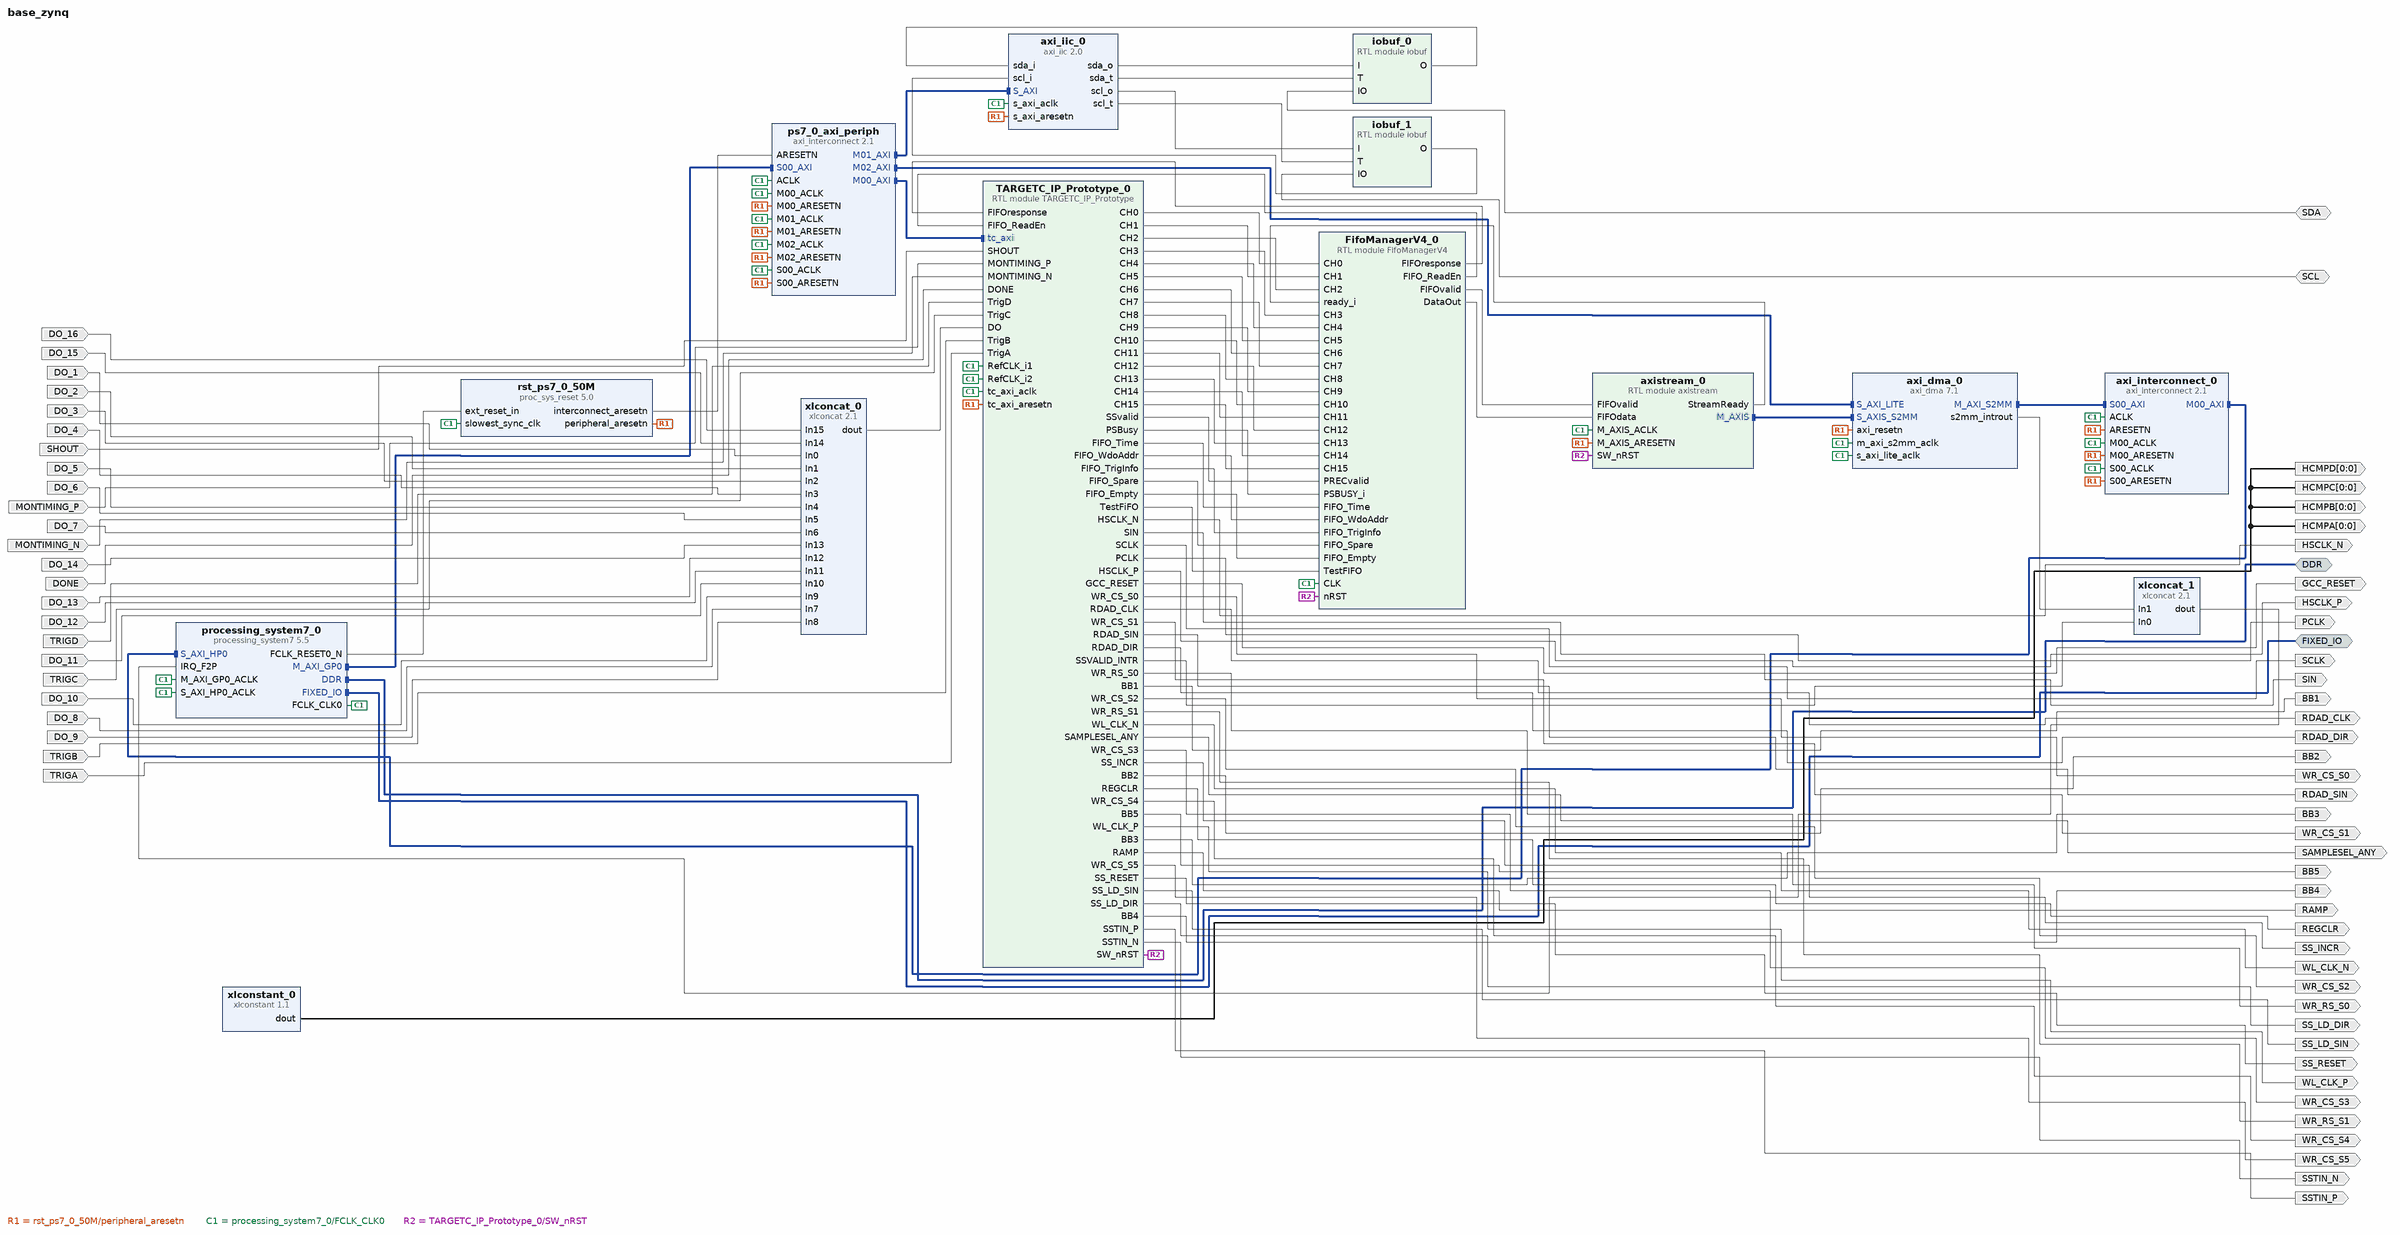
[diagram p0: block diagram of the top level]
# Vivado block design base_zynq, xc7z010clg400-1, Vivado 2018.2
create_bd_design base_zynq

create_bd_intf_port -mode Master -vlnv xilinx.com:interface:ddrx_rtl:1.0 DDR
create_bd_intf_port -mode Master -vlnv xilinx.com:display_processing_system7:fixedio_rtl:1.0 FIXED_IO
create_bd_port -dir I DO_16
create_bd_port -dir I DO_15
create_bd_port -dir I DO_1
create_bd_port -dir I DO_2
create_bd_port -dir I DO_3
create_bd_port -dir I DO_4
create_bd_port -dir I DO_5
create_bd_port -dir I DO_6
create_bd_port -dir I DO_7
create_bd_port -dir I DO_14
create_bd_port -dir I DO_13
create_bd_port -dir I DO_12
create_bd_port -dir I DO_11
create_bd_port -dir I DO_10
create_bd_port -dir I DO_8
create_bd_port -dir I DO_9
create_bd_port -dir IO SDA
create_bd_port -dir IO SCL
create_bd_port -dir O SIN
create_bd_port -dir O SCLK
create_bd_port -dir O PCLK
create_bd_port -dir O HSCLK_P
create_bd_port -dir O HSCLK_N
create_bd_port -dir O WR_RS_S1
create_bd_port -dir O WR_RS_S0
create_bd_port -dir O WR_CS_S0
create_bd_port -dir O WR_CS_S1
create_bd_port -dir O WR_CS_S2
create_bd_port -dir O WR_CS_S3
create_bd_port -dir O WR_CS_S4
create_bd_port -dir O WR_CS_S5
create_bd_port -dir O GCC_RESET
create_bd_port -dir O -type clk WL_CLK_P
create_bd_port -dir O -type clk WL_CLK_N
create_bd_port -dir O RDAD_CLK
create_bd_port -dir O RDAD_SIN
create_bd_port -dir O RDAD_DIR
create_bd_port -dir O SAMPLESEL_ANY
create_bd_port -dir O SS_INCR
create_bd_port -dir O -type rst SS_RESET
create_bd_port -dir O REGCLR
create_bd_port -dir O SS_LD_SIN
create_bd_port -dir O SS_LD_DIR
create_bd_port -dir O RAMP
create_bd_port -dir O SSTIN_P
create_bd_port -dir O SSTIN_N
create_bd_port -dir O BB1
create_bd_port -dir O BB5
create_bd_port -dir I SHOUT
create_bd_port -dir I MONTIMING_P
create_bd_port -dir I MONTIMING_N
create_bd_port -dir I DONE
create_bd_port -dir I TRIGD
create_bd_port -dir I TRIGC
create_bd_port -dir I TRIGB
create_bd_port -dir I TRIGA
create_bd_port -dir O -from 0 -to 0 HCMPA
create_bd_port -dir O -from 0 -to 0 HCMPB
create_bd_port -dir O -from 0 -to 0 HCMPC
create_bd_port -dir O -from 0 -to 0 HCMPD
create_bd_port -dir O BB2
create_bd_port -dir O BB3
create_bd_port -dir O BB4

create_bd_cell -type ip -vlnv xilinx.com:ip:axi_interconnect:2.1 ps7_0_axi_periph
set_property -dict {CONFIG.NUM_SI 1 CONFIG.NUM_MI 3} [get_bd_cells ps7_0_axi_periph]
create_bd_cell -type ip -vlnv xilinx.com:ip:processing_system7:5.5 processing_system7_0
set_property -dict [list \
  CONFIG.PCW_UIPARAM_DDR_FREQ_MHZ 533.333333 \
  CONFIG.PCW_APU_PERIPHERAL_FREQMHZ 666.666666 \
  CONFIG.PCW_SDIO_PERIPHERAL_FREQMHZ 50 \
  CONFIG.PCW_UART_PERIPHERAL_FREQMHZ 50 \
  CONFIG.PCW_FPGA0_PERIPHERAL_FREQMHZ 100 \
  CONFIG.PCW_FPGA1_PERIPHERAL_FREQMHZ 100 \
  CONFIG.PCW_USE_S_AXI_HP0 1 \
  CONFIG.PCW_USE_FABRIC_INTERRUPT 1 \
  CONFIG.PCW_S_AXI_HP0_DATA_WIDTH 32 \
  CONFIG.PCW_IRQ_F2P_INTR 1 \
  CONFIG.PCW_PERIPHERAL_BOARD_PRESET part0 \
  CONFIG.PCW_PRESET_BANK0_VOLTAGE {LVCMOS 2.5V} \
  CONFIG.PCW_PRESET_BANK1_VOLTAGE {LVCMOS 1.8V} \
  CONFIG.PCW_UIPARAM_DDR_PARTNO {MT41K256M16 RE-125} \
  CONFIG.PCW_QSPI_PERIPHERAL_ENABLE 1 \
  CONFIG.PCW_QSPI_QSPI_IO {MIO 1 .. 6} \
  CONFIG.PCW_QSPI_GRP_SINGLE_SS_ENABLE 1 \
  CONFIG.PCW_QSPI_GRP_SINGLE_SS_IO {MIO 1 .. 6} \
  CONFIG.PCW_SINGLE_QSPI_DATA_MODE x4 \
  CONFIG.PCW_QSPI_GRP_FBCLK_ENABLE 1 \
  CONFIG.PCW_QSPI_GRP_FBCLK_IO {MIO 8} \
  CONFIG.PCW_ENET0_PERIPHERAL_ENABLE 1 \
  CONFIG.PCW_ENET0_ENET0_IO {MIO 16 .. 27} \
  CONFIG.PCW_ENET0_GRP_MDIO_ENABLE 1 \
  CONFIG.PCW_ENET0_GRP_MDIO_IO {MIO 52 .. 53} \
  CONFIG.PCW_ENET_RESET_ENABLE 1 \
  CONFIG.PCW_ENET_RESET_SELECT {Share reset pin} \
  CONFIG.PCW_ENET0_RESET_ENABLE 1 \
  CONFIG.PCW_ENET0_RESET_IO {MIO 11} \
  CONFIG.PCW_SD0_PERIPHERAL_ENABLE 1 \
  CONFIG.PCW_SD0_SD0_IO {MIO 40 .. 45} \
  CONFIG.PCW_SD0_GRP_CD_ENABLE 1 \
  CONFIG.PCW_SD0_GRP_CD_IO {MIO 46} \
  CONFIG.PCW_SD0_GRP_WP_ENABLE 1 \
  CONFIG.PCW_SD0_GRP_WP_IO {MIO 50} \
  CONFIG.PCW_UART1_PERIPHERAL_ENABLE 1 \
  CONFIG.PCW_UART1_UART1_IO {MIO 48 .. 49} \
  CONFIG.PCW_TTC0_PERIPHERAL_ENABLE 1 \
  CONFIG.PCW_TTC0_TTC0_IO EMIO \
  CONFIG.PCW_USB0_PERIPHERAL_ENABLE 0 \
  CONFIG.PCW_USB_RESET_ENABLE 1 \
  CONFIG.PCW_I2C_RESET_ENABLE 1 \
  CONFIG.PCW_GPIO_MIO_GPIO_ENABLE 1 \
  CONFIG.PCW_GPIO_MIO_GPIO_IO MIO \
  CONFIG.PCW_ENET0_PERIPHERAL_FREQMHZ {100 Mbps} \
  CONFIG.preset ZC702 \
] [get_bd_cells processing_system7_0]
# 509 more settings of processing_system7_0 are not shown: defaults, MIO pin electricals, DDR timing, and values the tool derives
create_bd_cell -type ip -vlnv xilinx.com:ip:proc_sys_reset:5.0 rst_ps7_0_50M
create_bd_cell -type ip -vlnv xilinx.com:ip:xlconcat:2.1 xlconcat_0
set_property -dict {CONFIG.NUM_PORTS 16} [get_bd_cells xlconcat_0]
create_bd_cell -type ip -vlnv xilinx.com:ip:axi_iic:2.0 axi_iic_0
create_bd_cell -type ip -vlnv xilinx.com:ip:axi_dma:7.1 axi_dma_0
set_property -dict [list \
  CONFIG.c_include_sg 0 \
  CONFIG.c_micro_dma 0 \
  CONFIG.c_include_mm2s 0 \
  CONFIG.c_include_s2mm 1 \
  CONFIG.c_include_s2mm_dre 0 \
  CONFIG.c_s2mm_burst_size 128 \
] [get_bd_cells axi_dma_0]
create_bd_cell -type ip -vlnv xilinx.com:ip:axi_interconnect:2.1 axi_interconnect_0
set_property -dict {CONFIG.NUM_MI 1} [get_bd_cells axi_interconnect_0]
create_bd_cell -type ip -vlnv xilinx.com:ip:xlconcat:2.1 xlconcat_1
set_property -dict {CONFIG.NUM_PORTS 2} [get_bd_cells xlconcat_1]
create_bd_cell -type ip -vlnv xilinx.com:ip:xlconstant:1.1 xlconstant_0
set_property -dict {CONFIG.CONST_WIDTH 1 CONFIG.CONST_VAL 0} [get_bd_cells xlconstant_0]
create_bd_cell -type module -reference iobuf iobuf_1
create_bd_cell -type module -reference iobuf iobuf_0
create_bd_cell -type module -reference axistream axistream_0
create_bd_cell -type module -reference FifoManagerV4 FifoManagerV4_0
create_bd_cell -type module -reference TARGETC_IP_Prototype TARGETC_IP_Prototype_0

# ---- connections ----

connect_bd_intf_net [get_bd_intf_pins processing_system7_0/M_AXI_GP0] [get_bd_intf_pins ps7_0_axi_periph/S00_AXI]
connect_bd_intf_net [get_bd_intf_pins ps7_0_axi_periph/M01_AXI] [get_bd_intf_pins axi_iic_0/S_AXI]
connect_bd_intf_net [get_bd_intf_pins axistream_0/M_AXIS] [get_bd_intf_pins axi_dma_0/S_AXIS_S2MM]
connect_bd_intf_net [get_bd_intf_pins axi_dma_0/M_AXI_S2MM] [get_bd_intf_pins axi_interconnect_0/S00_AXI]
connect_bd_intf_net [get_bd_intf_pins axi_interconnect_0/M00_AXI] [get_bd_intf_pins processing_system7_0/S_AXI_HP0]
connect_bd_intf_net [get_bd_intf_pins ps7_0_axi_periph/M02_AXI] [get_bd_intf_pins axi_dma_0/S_AXI_LITE]
connect_bd_intf_net [get_bd_intf_pins ps7_0_axi_periph/M00_AXI] [get_bd_intf_pins TARGETC_IP_Prototype_0/tc_axi]
connect_bd_intf_net [get_bd_intf_ports DDR] [get_bd_intf_pins processing_system7_0/DDR]
connect_bd_intf_net [get_bd_intf_ports FIXED_IO] [get_bd_intf_pins processing_system7_0/FIXED_IO]
connect_bd_net [get_bd_pins processing_system7_0/FCLK_RESET0_N] [get_bd_pins rst_ps7_0_50M/ext_reset_in]
connect_bd_net [get_bd_pins rst_ps7_0_50M/peripheral_aresetn] \
  [get_bd_pins axi_iic_0/s_axi_aresetn] [get_bd_pins axi_dma_0/axi_resetn] [get_bd_pins axistream_0/M_AXIS_ARESETN] \
  [get_bd_pins ps7_0_axi_periph/S00_ARESETN] [get_bd_pins ps7_0_axi_periph/M00_ARESETN] \
  [get_bd_pins ps7_0_axi_periph/M01_ARESETN] [get_bd_pins axi_interconnect_0/ARESETN] \
  [get_bd_pins axi_interconnect_0/S00_ARESETN] [get_bd_pins axi_interconnect_0/M00_ARESETN] \
  [get_bd_pins ps7_0_axi_periph/M02_ARESETN] [get_bd_pins TARGETC_IP_Prototype_0/tc_axi_aresetn]
connect_bd_net -net ARESETN_1 [get_bd_pins rst_ps7_0_50M/interconnect_aresetn] [get_bd_pins ps7_0_axi_periph/ARESETN]
connect_bd_net -net DO_16_1 [get_bd_ports DO_16] [get_bd_pins xlconcat_0/In15]
connect_bd_net -net DO_15_1 [get_bd_ports DO_15] [get_bd_pins xlconcat_0/In14]
connect_bd_net -net DO_1_1 [get_bd_ports DO_1] [get_bd_pins xlconcat_0/In0]
connect_bd_net -net DO_2_1 [get_bd_ports DO_2] [get_bd_pins xlconcat_0/In1]
connect_bd_net -net DO_3_1 [get_bd_ports DO_3] [get_bd_pins xlconcat_0/In2]
connect_bd_net -net DO_4_1 [get_bd_ports DO_4] [get_bd_pins xlconcat_0/In3]
connect_bd_net -net DO_5_1 [get_bd_ports DO_5] [get_bd_pins xlconcat_0/In4]
connect_bd_net -net DO_6_1 [get_bd_ports DO_6] [get_bd_pins xlconcat_0/In5]
connect_bd_net -net DO_7_1 [get_bd_ports DO_7] [get_bd_pins xlconcat_0/In6]
connect_bd_net -net DO_14_1 [get_bd_ports DO_14] [get_bd_pins xlconcat_0/In13]
connect_bd_net -net DO_13_1 [get_bd_ports DO_13] [get_bd_pins xlconcat_0/In12]
connect_bd_net -net DO_12_1 [get_bd_ports DO_12] [get_bd_pins xlconcat_0/In11]
connect_bd_net -net DO_11_1 [get_bd_ports DO_11] [get_bd_pins xlconcat_0/In10]
connect_bd_net -net DO_10_1 [get_bd_ports DO_10] [get_bd_pins xlconcat_0/In9]
connect_bd_net -net DO_8_1 [get_bd_ports DO_8] [get_bd_pins xlconcat_0/In7]
connect_bd_net -net DO_9_1 [get_bd_ports DO_9] [get_bd_pins xlconcat_0/In8]
connect_bd_net [get_bd_pins processing_system7_0/FCLK_CLK0] \
  [get_bd_pins processing_system7_0/M_AXI_GP0_ACLK] [get_bd_pins rst_ps7_0_50M/slowest_sync_clk] \
  [get_bd_pins processing_system7_0/S_AXI_HP0_ACLK] [get_bd_pins axi_iic_0/s_axi_aclk] \
  [get_bd_pins axi_dma_0/s_axi_lite_aclk] [get_bd_pins axi_dma_0/m_axi_s2mm_aclk] [get_bd_pins axistream_0/M_AXIS_ACLK] \
  [get_bd_pins ps7_0_axi_periph/ACLK] [get_bd_pins ps7_0_axi_periph/S00_ACLK] [get_bd_pins ps7_0_axi_periph/M00_ACLK] \
  [get_bd_pins ps7_0_axi_periph/M01_ACLK] [get_bd_pins axi_interconnect_0/ACLK] [get_bd_pins axi_interconnect_0/S00_ACLK] \
  [get_bd_pins axi_interconnect_0/M00_ACLK] [get_bd_pins ps7_0_axi_periph/M02_ACLK] [get_bd_pins FifoManagerV4_0/CLK] \
  [get_bd_pins TARGETC_IP_Prototype_0/RefCLK_i1] [get_bd_pins TARGETC_IP_Prototype_0/RefCLK_i2] \
  [get_bd_pins TARGETC_IP_Prototype_0/tc_axi_aclk]
connect_bd_net [get_bd_ports SDA] [get_bd_pins iobuf_0/IO]
connect_bd_net [get_bd_pins iobuf_0/O] [get_bd_pins axi_iic_0/sda_i]
connect_bd_net [get_bd_pins axi_iic_0/sda_o] [get_bd_pins iobuf_0/I]
connect_bd_net [get_bd_pins axi_iic_0/sda_t] [get_bd_pins iobuf_0/T]
connect_bd_net [get_bd_ports SCL] [get_bd_pins iobuf_1/IO]
connect_bd_net [get_bd_pins iobuf_1/O] [get_bd_pins axi_iic_0/scl_i]
connect_bd_net [get_bd_pins axi_iic_0/scl_o] [get_bd_pins iobuf_1/I]
connect_bd_net [get_bd_pins axi_iic_0/scl_t] [get_bd_pins iobuf_1/T]
connect_bd_net [get_bd_pins axi_dma_0/s2mm_introut] [get_bd_pins xlconcat_1/In1]
connect_bd_net [get_bd_pins xlconcat_1/dout] [get_bd_pins processing_system7_0/IRQ_F2P]
connect_bd_net [get_bd_pins FifoManagerV4_0/FIFOresponse] [get_bd_pins TARGETC_IP_Prototype_0/FIFOresponse]
connect_bd_net [get_bd_pins FifoManagerV4_0/FIFOvalid] [get_bd_pins axistream_0/FIFOvalid]
connect_bd_net [get_bd_pins FifoManagerV4_0/DataOut] [get_bd_pins axistream_0/FIFOdata]
connect_bd_net [get_bd_pins axistream_0/StreamReady] [get_bd_pins FifoManagerV4_0/ready_i]
connect_bd_net [get_bd_pins xlconcat_0/dout] [get_bd_pins TARGETC_IP_Prototype_0/DO]
connect_bd_net [get_bd_pins TARGETC_IP_Prototype_0/SIN] [get_bd_ports SIN]
connect_bd_net [get_bd_pins TARGETC_IP_Prototype_0/SCLK] [get_bd_ports SCLK]
connect_bd_net [get_bd_pins TARGETC_IP_Prototype_0/PCLK] [get_bd_ports PCLK]
connect_bd_net [get_bd_pins TARGETC_IP_Prototype_0/HSCLK_P] [get_bd_ports HSCLK_P]
connect_bd_net [get_bd_pins TARGETC_IP_Prototype_0/HSCLK_N] [get_bd_ports HSCLK_N]
connect_bd_net [get_bd_pins TARGETC_IP_Prototype_0/WR_RS_S1] [get_bd_ports WR_RS_S1]
connect_bd_net [get_bd_pins TARGETC_IP_Prototype_0/WR_RS_S0] [get_bd_ports WR_RS_S0]
connect_bd_net [get_bd_pins TARGETC_IP_Prototype_0/WR_CS_S0] [get_bd_ports WR_CS_S0]
connect_bd_net [get_bd_pins TARGETC_IP_Prototype_0/WR_CS_S1] [get_bd_ports WR_CS_S1]
connect_bd_net [get_bd_pins TARGETC_IP_Prototype_0/WR_CS_S2] [get_bd_ports WR_CS_S2]
connect_bd_net [get_bd_pins TARGETC_IP_Prototype_0/WR_CS_S3] [get_bd_ports WR_CS_S3]
connect_bd_net [get_bd_pins TARGETC_IP_Prototype_0/WR_CS_S4] [get_bd_ports WR_CS_S4]
connect_bd_net [get_bd_pins TARGETC_IP_Prototype_0/WR_CS_S5] [get_bd_ports WR_CS_S5]
connect_bd_net [get_bd_pins TARGETC_IP_Prototype_0/GCC_RESET] [get_bd_ports GCC_RESET]
connect_bd_net [get_bd_pins TARGETC_IP_Prototype_0/WL_CLK_P] [get_bd_ports WL_CLK_P]
connect_bd_net [get_bd_pins TARGETC_IP_Prototype_0/WL_CLK_N] [get_bd_ports WL_CLK_N]
connect_bd_net [get_bd_pins TARGETC_IP_Prototype_0/RDAD_CLK] [get_bd_ports RDAD_CLK]
connect_bd_net [get_bd_pins TARGETC_IP_Prototype_0/RDAD_SIN] [get_bd_ports RDAD_SIN]
connect_bd_net [get_bd_pins TARGETC_IP_Prototype_0/RDAD_DIR] [get_bd_ports RDAD_DIR]
connect_bd_net [get_bd_pins TARGETC_IP_Prototype_0/SAMPLESEL_ANY] [get_bd_ports SAMPLESEL_ANY]
connect_bd_net [get_bd_pins TARGETC_IP_Prototype_0/SS_INCR] [get_bd_ports SS_INCR]
connect_bd_net [get_bd_pins TARGETC_IP_Prototype_0/SS_RESET] [get_bd_ports SS_RESET]
connect_bd_net [get_bd_pins TARGETC_IP_Prototype_0/REGCLR] [get_bd_ports REGCLR]
connect_bd_net [get_bd_pins TARGETC_IP_Prototype_0/SS_LD_SIN] [get_bd_ports SS_LD_SIN]
connect_bd_net [get_bd_pins TARGETC_IP_Prototype_0/SS_LD_DIR] [get_bd_ports SS_LD_DIR]
connect_bd_net [get_bd_pins TARGETC_IP_Prototype_0/RAMP] [get_bd_ports RAMP]
connect_bd_net [get_bd_pins TARGETC_IP_Prototype_0/SSTIN_P] [get_bd_ports SSTIN_P]
connect_bd_net [get_bd_pins TARGETC_IP_Prototype_0/SSTIN_N] [get_bd_ports SSTIN_N]
connect_bd_net [get_bd_pins TARGETC_IP_Prototype_0/CH0] [get_bd_pins FifoManagerV4_0/CH0]
connect_bd_net [get_bd_pins TARGETC_IP_Prototype_0/CH1] [get_bd_pins FifoManagerV4_0/CH1]
connect_bd_net [get_bd_pins TARGETC_IP_Prototype_0/CH2] [get_bd_pins FifoManagerV4_0/CH2]
connect_bd_net [get_bd_pins TARGETC_IP_Prototype_0/CH3] [get_bd_pins FifoManagerV4_0/CH3]
connect_bd_net [get_bd_pins TARGETC_IP_Prototype_0/CH4] [get_bd_pins FifoManagerV4_0/CH4]
connect_bd_net [get_bd_pins TARGETC_IP_Prototype_0/CH5] [get_bd_pins FifoManagerV4_0/CH5]
connect_bd_net [get_bd_pins TARGETC_IP_Prototype_0/CH6] [get_bd_pins FifoManagerV4_0/CH6]
connect_bd_net [get_bd_pins TARGETC_IP_Prototype_0/CH7] [get_bd_pins FifoManagerV4_0/CH7]
connect_bd_net [get_bd_pins TARGETC_IP_Prototype_0/CH8] [get_bd_pins FifoManagerV4_0/CH8]
connect_bd_net [get_bd_pins TARGETC_IP_Prototype_0/CH9] [get_bd_pins FifoManagerV4_0/CH9]
connect_bd_net [get_bd_pins TARGETC_IP_Prototype_0/CH10] [get_bd_pins FifoManagerV4_0/CH10]
connect_bd_net [get_bd_pins TARGETC_IP_Prototype_0/CH11] [get_bd_pins FifoManagerV4_0/CH11]
connect_bd_net [get_bd_pins TARGETC_IP_Prototype_0/CH12] [get_bd_pins FifoManagerV4_0/CH12]
connect_bd_net [get_bd_pins TARGETC_IP_Prototype_0/CH13] [get_bd_pins FifoManagerV4_0/CH13]
connect_bd_net [get_bd_pins TARGETC_IP_Prototype_0/CH14] [get_bd_pins FifoManagerV4_0/CH14]
connect_bd_net [get_bd_pins TARGETC_IP_Prototype_0/CH15] [get_bd_pins FifoManagerV4_0/CH15]
connect_bd_net [get_bd_pins TARGETC_IP_Prototype_0/SSvalid] [get_bd_pins FifoManagerV4_0/PRECvalid]
connect_bd_net [get_bd_pins TARGETC_IP_Prototype_0/SSVALID_INTR] [get_bd_pins xlconcat_1/In0]
connect_bd_net -net TARGETC_IP_Prototype_0_SSTIN [get_bd_pins TARGETC_IP_Prototype_0/BB1] [get_bd_ports BB1]
connect_bd_net -net TARGETC_IP_Prototype_0_MONTIMING [get_bd_pins TARGETC_IP_Prototype_0/BB5] [get_bd_ports BB5]
connect_bd_net [get_bd_ports SHOUT] [get_bd_pins TARGETC_IP_Prototype_0/SHOUT]
connect_bd_net [get_bd_ports MONTIMING_P] [get_bd_pins TARGETC_IP_Prototype_0/MONTIMING_P]
connect_bd_net [get_bd_ports MONTIMING_N] [get_bd_pins TARGETC_IP_Prototype_0/MONTIMING_N]
connect_bd_net [get_bd_ports DONE] [get_bd_pins TARGETC_IP_Prototype_0/DONE]
connect_bd_net [get_bd_ports TRIGD] [get_bd_pins TARGETC_IP_Prototype_0/TrigD]
connect_bd_net [get_bd_ports TRIGC] [get_bd_pins TARGETC_IP_Prototype_0/TrigC]
connect_bd_net [get_bd_ports TRIGB] [get_bd_pins TARGETC_IP_Prototype_0/TrigB]
connect_bd_net [get_bd_ports TRIGA] [get_bd_pins TARGETC_IP_Prototype_0/TrigA]
connect_bd_net [get_bd_pins xlconstant_0/dout] [get_bd_ports HCMPD] [get_bd_ports HCMPC] [get_bd_ports HCMPB] [get_bd_ports HCMPA]
connect_bd_net [get_bd_pins TARGETC_IP_Prototype_0/BB2] [get_bd_ports BB2]
connect_bd_net [get_bd_pins TARGETC_IP_Prototype_0/BB3] [get_bd_ports BB3]
connect_bd_net [get_bd_pins TARGETC_IP_Prototype_0/BB4] [get_bd_ports BB4]
connect_bd_net [get_bd_pins TARGETC_IP_Prototype_0/SW_nRST] [get_bd_pins axistream_0/SW_nRST] [get_bd_pins FifoManagerV4_0/nRST]
connect_bd_net [get_bd_pins TARGETC_IP_Prototype_0/PSBusy] [get_bd_pins FifoManagerV4_0/PSBUSY_i]
connect_bd_net [get_bd_pins TARGETC_IP_Prototype_0/FIFO_Time] [get_bd_pins FifoManagerV4_0/FIFO_Time]
connect_bd_net [get_bd_pins TARGETC_IP_Prototype_0/FIFO_WdoAddr] [get_bd_pins FifoManagerV4_0/FIFO_WdoAddr]
connect_bd_net [get_bd_pins TARGETC_IP_Prototype_0/FIFO_TrigInfo] [get_bd_pins FifoManagerV4_0/FIFO_TrigInfo]
connect_bd_net [get_bd_pins TARGETC_IP_Prototype_0/FIFO_Spare] [get_bd_pins FifoManagerV4_0/FIFO_Spare]
connect_bd_net [get_bd_pins TARGETC_IP_Prototype_0/FIFO_Empty] [get_bd_pins FifoManagerV4_0/FIFO_Empty]
connect_bd_net [get_bd_pins FifoManagerV4_0/FIFO_ReadEn] [get_bd_pins TARGETC_IP_Prototype_0/FIFO_ReadEn]
connect_bd_net [get_bd_pins TARGETC_IP_Prototype_0/TestFiFO] [get_bd_pins FifoManagerV4_0/TestFIFO]

# ---- address map ----
assign_bd_address -offset 0x00000000 -range 1G -target_address_space [get_bd_addr_spaces axi_dma_0/Data_S2MM] [get_bd_addr_segs processing_system7_0/S_AXI_HP0/HP0_DDR_LOWOCM]
assign_bd_address -offset 0x40400000 -range 64K -target_address_space [get_bd_addr_spaces processing_system7_0/Data] [get_bd_addr_segs axi_dma_0/S_AXI_LITE/Reg]
assign_bd_address -offset 0x41600000 -range 64K -target_address_space [get_bd_addr_spaces processing_system7_0/Data] [get_bd_addr_segs axi_iic_0/S_AXI/Reg]
assign_bd_address -offset 0x60000000 -range 512M -target_address_space [get_bd_addr_spaces processing_system7_0/Data] [get_bd_addr_segs TARGETC_IP_Prototype_0/tc_axi/reg0]

validate_bd_design
save_bd_design
